# Altium project nora chirp.PrjPCB
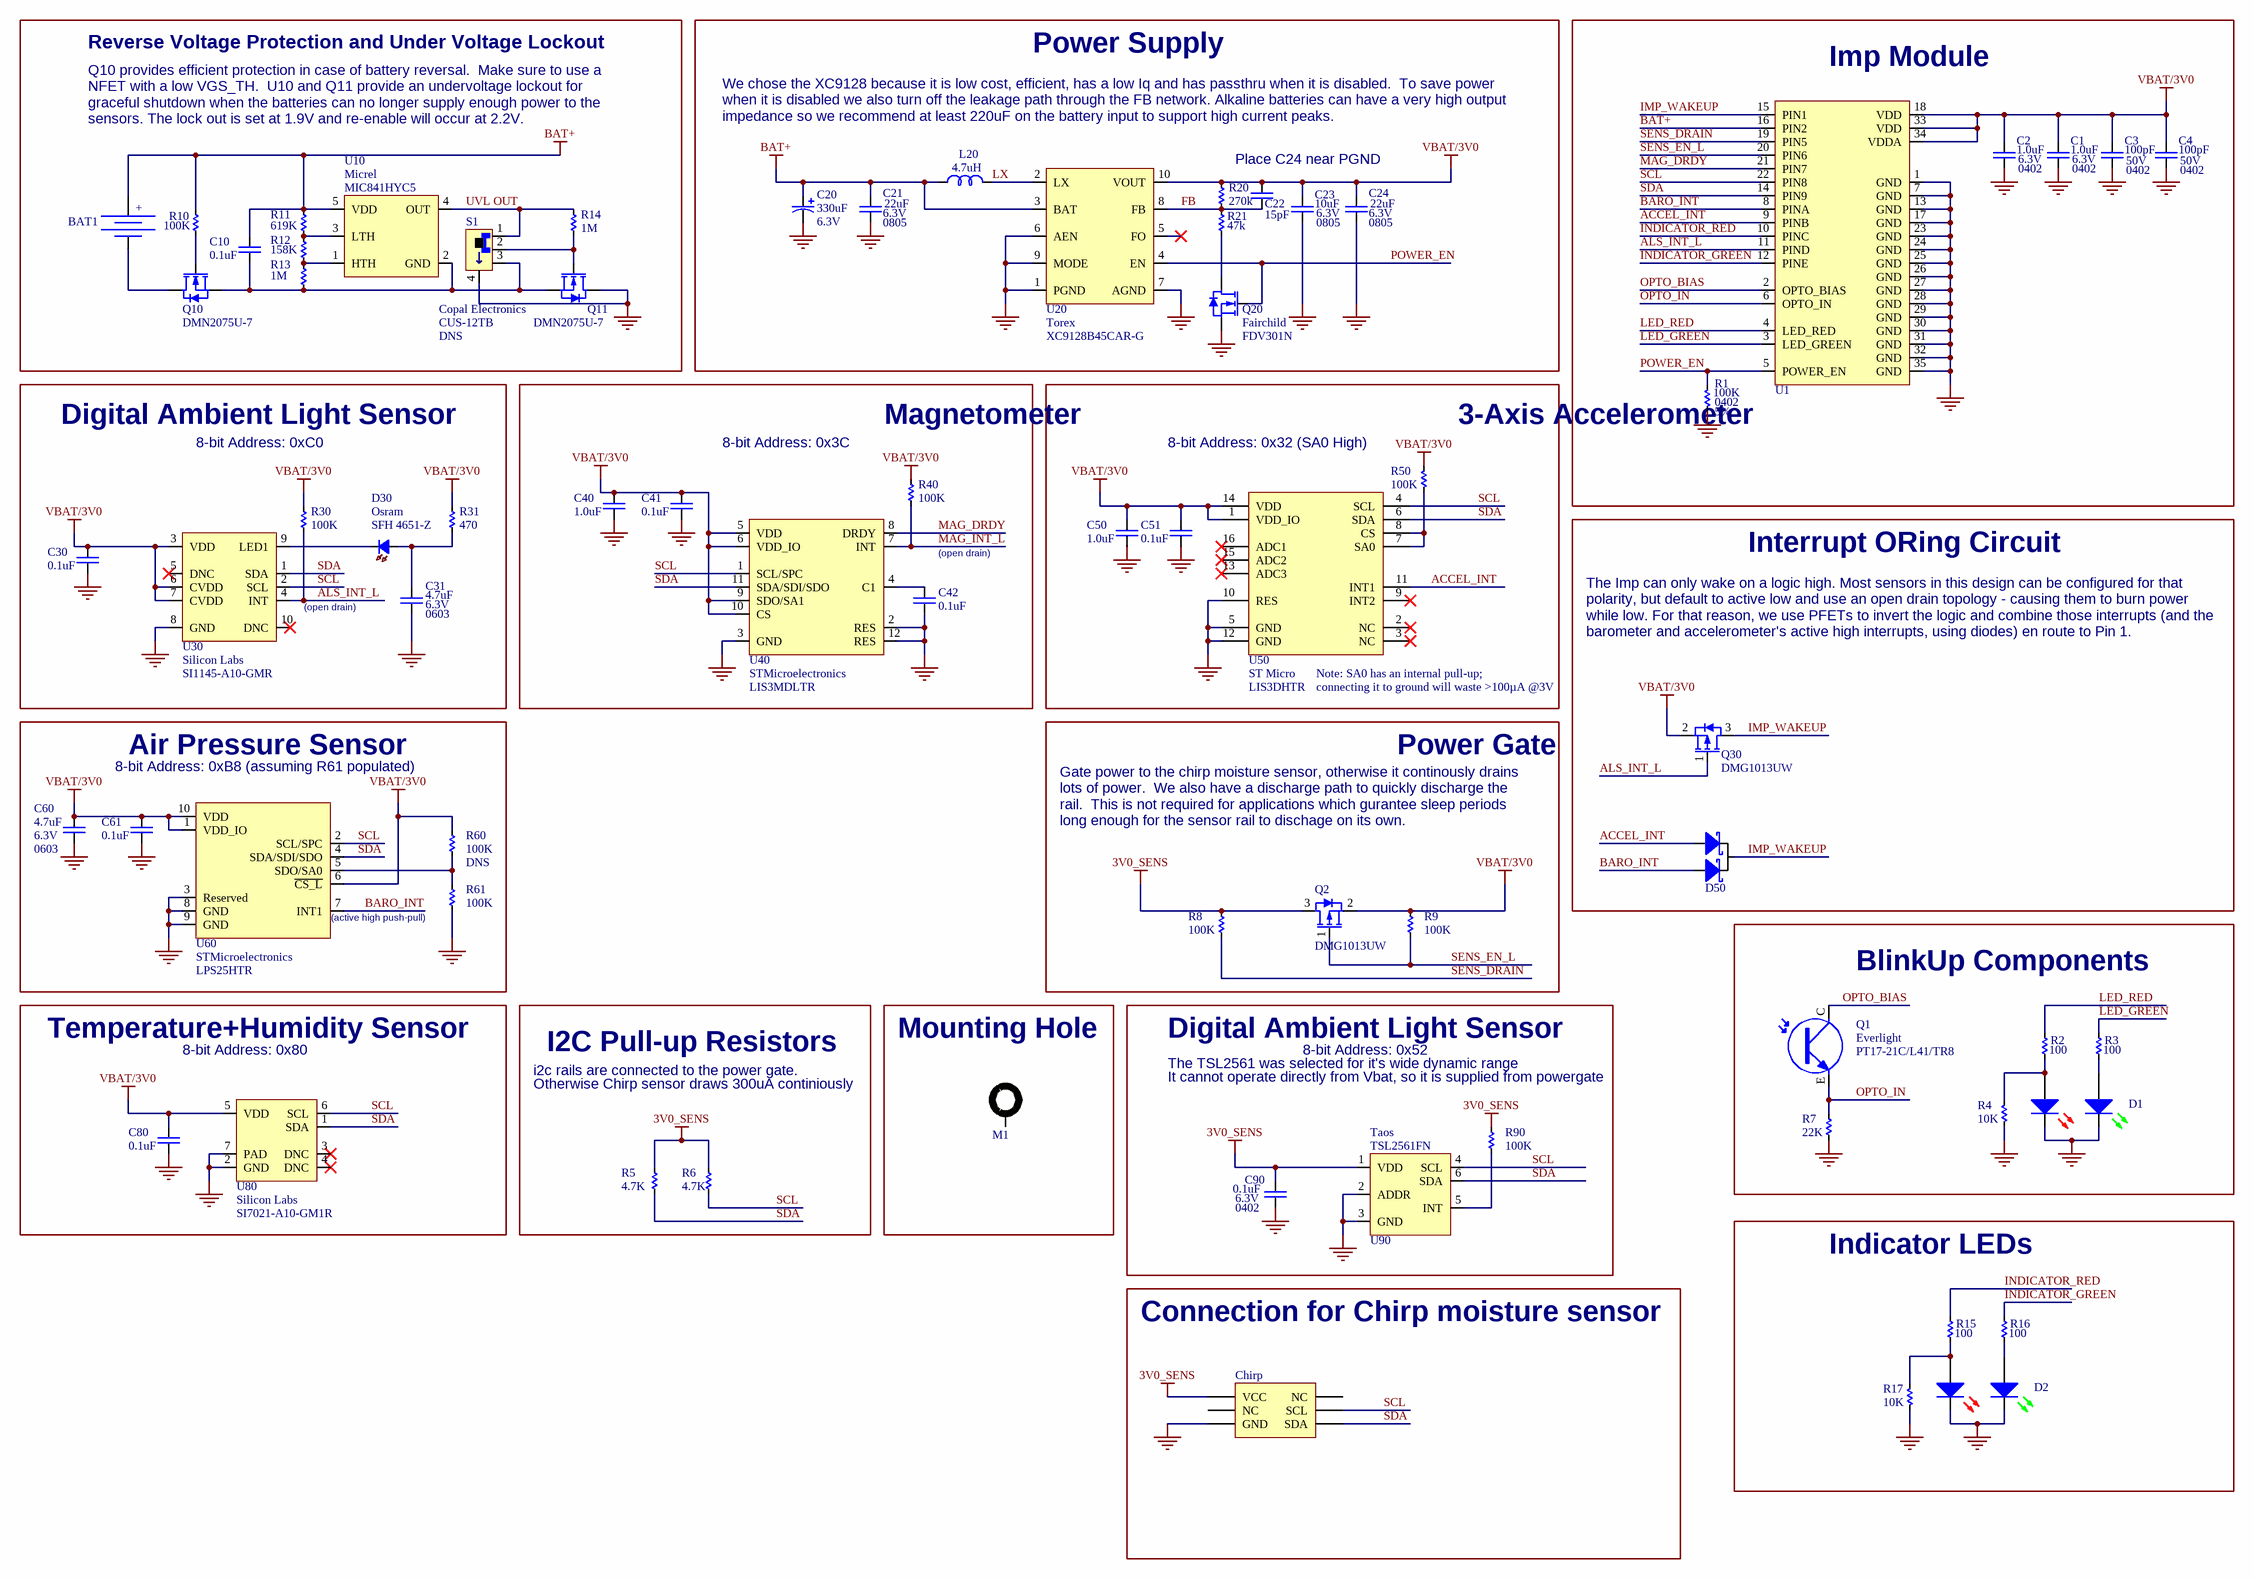
[diagram p0: nora_chirp.SchDoc]
1 sheet, 71 parts. Net scope: global (net labels, ports and power ports of the same name join across sheets).
Board file: nora_chirp.PcbDoc

## Sheet nora_chirp.SchDoc: Impee Nora
size A2; Revision: 5.0; SheetNumber: 1; SheetTotal: 1; PageSetup: Record=PageOptions|CenterHorizontal=True|CenterVertical=True|PrintScale=0.90|XCorrection=1.00|YCorrection=1.00|PrintKind=0|BorderSize=5000000|LeftOffset=0|BottomOffset=0|Orientation=2|PaperLength=1000|PaperWidth=1000|Scale=100|PaperSource=276|PrintQuality=-3|MediaType=1|DitherType=10|PrintScaleMode=1|PaperKind=Tabloid|PaperIndex=3; ProjectName: impee-nora

### Parts
BAT1  BATTERY  [12BH321P-GR]  (value not drawn)
C1  value 1.0uF  Voltage: 6.3V  Package: 0402  [CAPC1005X07N]  (hidden comment: Ceramic Capacitor)
C2  value 1.0uF  Voltage: 6.3V  Package: 0402  [CAPC1005X07N]  (hidden comment: Ceramic Capacitor)
C3  value 100pF  Voltage: 50V  Package: 0402  [CAPC1005X07N]  (hidden comment: Ceramic Capacitor)
C4  value 100pF  Voltage: 50V  Package: 0402  [CAPC1005X07N]  (hidden comment: Ceramic Capacitor)
C10  value 0.1uF  [CAPC1005X07N]  (hidden comment: Ceramic Capacitor)
C20  value 330uF  Voltage: 6.3V  [CAPAE8983X55N]  (hidden comment: Polarized Capacitor)
C21  value 22uF  Voltage: 6.3V  Package: 0805  [CAPC2012X14N]  (hidden comment: Ceramic Capacitor)
C22  value 15pF  [CAPC1005X07N]  (hidden comment: Ceramic Capacitor)
C23  value 10uF  Voltage: 6.3V  Package: 0805  [CAPC2012X14N]  (hidden comment: Ceramic Capacitor)
C24  value 22uF  Voltage: 6.3V  Package: 0805  [CAPC2012X14N]  (hidden comment: Ceramic Capacitor)
C30  value 0.1uF  [CAPC1005X07N]  (hidden comment: Ceramic Capacitor)
C31  value 4.7uF  Voltage: 6.3V  Package: 0603  [CAPC1608X10N]  (hidden comment: Ceramic Capacitor)
C40  value 1.0uF  [CAPC1005X07N]  (hidden comment: Ceramic Capacitor)
C41  value 0.1uF  [CAPC1005X07N]  (hidden comment: Ceramic Capacitor)
C42  value 0.1uF  [CAPC1005X07N]  (hidden comment: Ceramic Capacitor)
C50  value 1.0uF  [CAPC1005X07N]  (hidden comment: Ceramic Capacitor)
C51  value 0.1uF  [CAPC1005X07N]  (hidden comment: Ceramic Capacitor)
C60  value 4.7uF  Voltage: 6.3V  Package: 0603  [CAPC1608X10N]  (hidden comment: Ceramic Capacitor)  (no BOM)
C61  value 0.1uF  [CAPC1005X07N]  (hidden comment: Ceramic Capacitor)
C80  value 0.1uF  [CAPC1005X07N]  (hidden comment: Ceramic Capacitor)
C90  value 0.1uF  Voltage: 6.3V  Package: 0402  [CAPC1005X07N]  (hidden comment: Ceramic Capacitor)
Chirp  (no value)  [Chirp HDR3+1]
D1  LED Red and Green  [LED1616X07N-REDGREEN]  (value not drawn)
D2  LED Red and Green  [LED1616X07N-REDGREEN]  (value not drawn)
D30  Manufacturer: Osram  Manufacturer Part Number: SFH 4651-Z  [LED3324X17N]  (hidden comment: LED IR)
D50  Dual Schottky Diode  [SOT95P300X130-3N]  (value not drawn)
L20  value 4.7uH  [INDP6060X28N]  (hidden comment: Inductor)
M1  Mounting Hole  [4-40-NP]  (value not drawn)  (no BOM)
Q1  Manufacturer: Everlight  Manufacturer Part Number: PT17-21C/L41/TR8  [PHOTOTRANS2012X13]  (hidden comment: PHOTOTRANSISTOR)
Q2  Manufacturer Part Number: DMG1013UW  [SOT65P210X110-3N]  (hidden comment: PFET)
Q10  Manufacturer Part Number: DMN2075U-7  [SOT95P300X130-3N]  (hidden comment: N-Channel MOSFET)
Q11  Manufacturer Part Number: DMN2075U-7  [SOT95P300X130-3N]  (hidden comment: N-Channel MOSFET)
Q20  Manufacturer: Fairchild  Manufacturer Part Number: FDV301N  [SOT95P300X130-3N]  (hidden comment: N-Channel MOSFET)
Q30  Manufacturer Part Number: DMG1013UW  [SOT65P210X110-3N]  (hidden comment: PFET)  (no BOM)
R1  value 100K  Package: 0402  Tolerance: 5%  [RESC1005X04N]  (hidden comment: Resistor)
R2  value 100  [RESC1005X04N]  (hidden comment: Resistor)
R3  value 100  [RESC1005X04N]  (hidden comment: Resistor)
R4  value 10K  [RESC1005X04N]  (hidden comment: Resistor)
R5  value 4.7K  [RESC1005X04N]  (hidden comment: Resistor)
R6  value 4.7K  [RESC1005X04N]  (hidden comment: Resistor)
R7  value 22K  [RESC1005X04N]  (hidden comment: Resistor)
R8  value 100K  [RESC1005X04N]  (hidden comment: Resistor)
R9  value 100K  [RESC1005X04N]  (hidden comment: Resistor)
R10  value 100K  [RESC1005X04N]  (hidden comment: Resistor)
R11  value 619K  [RESC1005X04N]  (hidden comment: Resistor)
R12  value 158K  [RESC1005X04N]  (hidden comment: Resistor)
R13  value 1M  [RESC1005X04N]  (hidden comment: Resistor)
R14  value 1M  [RESC1005X04N]  (hidden comment: Resistor)
R15  value 100  [RESC1005X04N]  (hidden comment: Resistor)
R16  value 100  [RESC1005X04N]  (hidden comment: Resistor)
R17  value 10K  [RESC1005X04N]  (hidden comment: Resistor)
R20  value 270k  [RESC1005X04N]  (hidden comment: Resistor)
R21  value 47k  [RESC1005X04N]  (hidden comment: Resistor)
R30  value 100K  [RESC1005X04N]  (hidden comment: Resistor)
R31  value 470  [RESC1005X04N]  (hidden comment: Resistor)
R40  value 100K  [RESC1005X04N]  (hidden comment: Resistor)
R50  value 100K  [RESC1005X04N]  (hidden comment: Resistor)
R60  value 100K  BOMOPTION: DNS  [RESC1005X04N]  (hidden comment: Resistor)  (no BOM)
R61  value 100K  [RESC1005X04N]  (hidden comment: Resistor)
R90  value 100K  [RESC1005X04N]  (hidden comment: Resistor)
S1  Manufacturer: Copal Electronics  BOMOPTION: DNS  [CUS-12TB]  (hidden comment: Slide Switch)  (no BOM)
U1  imp module  [IMP_MODULE]  (value not drawn)
U10  Manufacturer: Micrel  Manufacturer Part Number: MIC841HYC5  [SOT65P200X125-5N]  (hidden comment: MIC841)
U20  Manufacturer: Torex  Manufacturer Part Number: XC9128B45CAR-G  [MSOP50P490X116-10N]  (hidden comment: XC9128)
U30  Manufacturer: Silicon Labs  Manufacturer Part Number: SI1145-A10-GMR  [QFN50P200X200X75-10N]  (hidden comment: SI1145)
U40  Manufacturer: STMicroelectronics  Manufacturer Part Number: LIS3MDLTR  [PQFN50P200X200X100-12N]  (hidden comment: LIS3MDL)  (no BOM)
U50  Manufacturer: ST Micro  [LGA50P300X300X100-16N-ST]  (hidden comment: LIS3DHTR)
U60  Manufacturer: STMicroelectronics  Manufacturer Part Number: LPS25HTR  [PQFN60P250X250X100-10N]  (hidden comment: LPS25H)  (no BOM)
U80  Manufacturer: Silicon Labs  Manufacturer Part Number: SI7021-A10-GM1R  [QFN100P300X300X80_HS-7N]  (hidden comment: SI7021)
U90  Manufacturer: Taos  Manufacturer Part Number: TSL2561FN  [TSL2561]  (hidden comment: TSL2561)

### Blocks framed on the sheet
Reverse Voltage Protection and Under Voltage Lockout: BAT1 C10 Q10 Q11 R10-R14 S1 U10
Power Supply: C20-C24 L20 Q20 R20 R21 U20
Imp Module: C1-C4 R1 U1
Digital Ambient Light Sensor: C30 C31 D30 R30 R31 U30
Magnetometer: C40-C42 R40 U40
3-Axis Accelerometer: C50 C51 R50 U50
Interrupt ORing Circuit: D50 Q30
Air Pressure Sensor: C60 C61 R60 R61 U60
Power Gate: Q2 R8 R9
BlinkUp Components: D1 Q1 R2-R4 R7
Temperature+Humidity Sensor: C80 U80
I2C Pull-up Resistors: R5 R6
Mounting Hole: M1
Digital Ambient Light Sensor: C90 R90 U90
Indicator LEDs: D2 R15-R17
Connection for Chirp moisture sensor: Chirp

### Nets
3V0_SENS: C90.2 Chirp.1(VCC) Q2.3(D) R5.1 R6.1 R8.1 R90.1 U90.1(VDD)
BAT+: BAT1.+ C10.2 C20.1 C21.2 L20.1 R10.2 R11.1 U1.16(PIN2) U10.5(VDD) U20.3(BAT)
GND: C1.1 C2.1 C3.1 C4.1 C20.2 C21.1 C23.1 C24.1 C30.1 C31.1 C40.1 C41.1 C42.1 C50.1 C51.1 C60.1 C61.1 C80.1 C90.1 Chirp.3(GND) D1.KG D1.KR D2.KG D2.KR Q11.3(D) Q20.2(S) R1.1 R4.1 R7.2 R17.1 R61.2 S1.4 U1.1(GND) U1.7(GND) U1.13(GND) U1.17(GND) U1.23(GND) U1.24(GND) U1.25(GND) U1.26(GND) U1.27(GND) U1.28(GND) U1.29(GND) U1.30(GND) U1.31(GND) U1.32(GND) U1.35(GND) U20.1(PGND) U20.6(AEN) U20.7(AGND) U20.9(MODE) U30.8(GND) U40.2(RES) U40.3(GND) U40.12(RES) U50.5(GND) U50.10(RES) U50.12(GND) U60.3(Reserved) U60.8(GND) U60.9(GND) U80.2(GND) U80.7(PAD) U90.2(ADDR) U90.3(GND)
VBAT/3V0: C1.2 C2.2 C3.2 C4.2 C22.2 C23.2 C24.2 C30.2 C40.2 C41.2 C50.2 C51.2 C60.2 C61.2 C80.2 Q2.2(S) Q30.2(S) R9.1 R20.1 R30.1 R31.1 R40.1 R50.2 R60.1 U1.18(VDD) U1.33(VDD) U1.34(VDDA) U20.10(VOUT) U30.3(VDD) U30.6(CVDD) U30.7(CVDD) U40.5(VDD) U40.6(VDD_IO) U40.9(SDO/SA1) U40.10(CS) U50.1(VDD_IO) U50.14(VDD) U60.1(VDD_IO) U60.6(~{CS_L}) U60.10(VDD) U80.5(VDD)
ACCEL_INT: D50.1 U1.9(PINB) U50.11(INT1)
ALS_INT_L: Q30.1(G) R30.2 U1.11(PIND) U30.4(INT)
BARO_INT: D50.2 U1.8(PINA) U60.7(INT1)
FB: C22.1 R20.2 R21.2 U20.8(FB)
IMP_WAKEUP: D50.3 Q30.3(D) U1.15(PIN1)
INDICATOR_GREEN: R16.1 U1.12(PINE)
INDICATOR_RED: R15.1 U1.10(PINC)
LED_GREEN: R3.1 U1.3(LED_GREEN)
LED_RED: R2.1 U1.4(LED_RED)
LX: L20.2 U20.2(LX)
MAG_DRDY: U1.21(PIN7) U40.8(DRDY)
MAG_INT_L: R40.2 U40.7(INT)
OPTO_BIAS: Q1.C U1.2(OPTO_BIAS)
OPTO_IN: Q1.E R7.1 U1.6(OPTO_IN)
POWER_EN: Q20.1(G) R1.2 U1.5(POWER_EN) U20.4(EN)
SCL: Chirp.5(SCL) R6.2 U1.22(PIN8) U30.2(SCL) U40.1(SCL/SPC) U50.4(SCL) U60.2(SCL/SPC) U80.6(SCL) U90.4(SCL)
SDA: Chirp.2(SDA) R5.2 U1.14(PIN9) U30.1(SDA) U40.11(SDA/SDI/SDO) U50.6(SDA) U60.4(SDA/SDI/SDO) U80.1(SDA) U90.6(SDA)
SENS_DRAIN: R8.2 U1.19(PIN5)
SENS_EN_L: Q2.1(G) R9.2 U1.20(PIN6)
UVL OUT: R14.1 S1.1 U10.4(OUT)
NetBAT1_-: BAT1.- Q10.3(D)
NetC10_1: C10.1 Q10.2(S) Q11.2(S) R13.2 S1.3 U10.2(GND)
NetC31_2: C31.2 D30.A R31.2
NetC42_2: C42.2 U40.4(C1)
NetD1_AG: D1.AG R3.2
NetD1_AR: D1.AR R2.2 R4.2
NetD2_AG: D2.AG R16.2
NetD2_AR: D2.AR R15.2 R17.2
NetD30_K: D30.K U30.9(LED1)
NetQ10_1: Q10.1(G) R10.1
NetQ11_1: Q11.1(G) R14.2 S1.2
NetQ20_3: Q20.3(D) R21.1
NetR11_2: R11.2 R12.1 U10.3(LTH)
NetR12_2: R12.2 R13.1 U10.1(HTH)
NetR50_1: R50.1 U50.7(SA0) U50.8(CS)
NetR60_2: R60.2 R61.1 U60.5(SDO/SA0)
NetR90_2: R90.2 U90.5(INT)

Not connected (* = marked no-connect by the designer): Chirp 4(NC) 6(NC); M1 1; U20 5(FO)*; U30 5(DNC)* 10(DNC)*; U50 2(NC)* 3(NC)* 9(INT2)* 13(ADC3)* 15(ADC2)* 16(ADC1)*; U80 3(DNC)* 4(DNC)*

### Notes on the sheet
- Q10 provides efficient protection in case of battery reversal.  Make sure to use a NFET with a low VGS_TH.  U10 and Q11 provide an undervoltage lockout for graceful shutdown when the batteries can no longer supply enough power to the sensors. The lock out is set at 1.9V and re-enable will occur at 2.2V.
- We chose the XC9128 because it is low cost, efficient, has a low Iq and has passthru when it is disabled.  To save power when it is disabled we also turn off the leakage path through the FB network. Alkaline batteries can have a very high output impedance so we recommend at least 220uF on the battery input to support high current peaks.
- Place C24 near PGND
- 8-bit Address: 0xC0
- 8-bit Address: 0x3C
- 8-bit Address: 0x32 (SA0 High)
- (near U30) (open drain)
- (open drain)
- (near U50) Note: SA0 has an internal pull-up;
- The Imp can only wake on a logic high. Most sensors in this design can be configured for that polarity, but default to active low and use an open drain topology - causing them to burn power while low. For that reason, we use PFETs to invert the logic and combine those interrupts (and the barometer and accelerometer's active high interrupts, using diodes) en route to Pin 1.
- (near U50) connecting it to ground will waste >100µA @3V
- 8-bit Address: 0xB8 (assuming R61 populated)
- Gate power to the chirp moisture sensor, otherwise it continously drains lots of power.  We also have a discharge path to quickly discharge the rail.  This is not required for applications which gurantee sleep periods long enough for the sensor rail to dischage on its own.
- (near U60) (active high push-pull)
- 8-bit Address: 0x80
- i2c rails are connected to the power gate.
- The TSL2561 was selected for it's wide dynamic range
- (near R90) It cannot operate directly from Vbat, so it is supplied from powergate
- 8-bit Address: 0x52
- Otherwise Chirp sensor draws 300uA continiously
- Copyright © 2014, Electric Imp Inc.
  Permission is hereby granted, free of charge, to any person obtaining a copy of this work and associated documentation files (the "Work"), to deal in the Work without restriction, including without limitation the rights to use, copy, modify, merge, publish, distribute, sublicense, and/or sell copies of the Work, and to permit persons to whom the Work is furnished to do so, subject to the following conditions:
  The above copyright notice and this permission notice shall be included in all copies or substantial portions of the Work.
  THE WORK IS PROVIDED "AS IS", WITHOUT WARRANTY OF ANY KIND, EXPRESS OR IMPLIED, INCLUDING BUT NOT LIMITED TO THE WARRANTIES OF MERCHANTABILITY, FITNESS FOR A PARTICULAR PURPOSE AND NONINFRINGEMENT. IN NO EVENT SHALL THE AUTHORS OR COPYRIGHT HOLDERS BE LIABLE FOR ANY CLAIM, DAMAGES OR OTHER LIABILITY, WHETHER IN AN ACTION OF CONTRACT, TORT OR OTHERWISE, ARISING FROM, OUT OF OR IN CONNECTION WITH THE WORK OR THE USE OR OTHER DEALINGS IN THE WORK.
- Design:
- Sheet:
- of
- Date:
- Time:
- Rev:
- Electric Imp
- 5050 El Camino Real, #221
- Los Altos, CA 94022
- File:

### Library data of the parts
BAT1 = BAT00006: 2xAA Series Battery Clip with Through-Hole PCB Mount; Manufacturer: Eagle Plastic Devices; Part Number: BAT00006; Manufacturer Part Number: 12BH321P-GR; Supplier 1: Mouser; Supplier Part Number 1: 12BH321P-GR; Supplier Price 1: 0.33; ComponentLink1URL: http://www.mouser.com/ProductDetail/Eagle-Plastic-Devices/12BH321P-GR/?qs=sGAEpiMZZMt13fpse6CWDe8CZN6lv7uJ5DFrvufekr8%3d
C1 C2 C40 C50 = CAPC00005: CAP,X5R,1.0uF,10%,6.3V, 0402,#; Manufacturer: Murata; Manufacturer Part Number: GRM155R60J105KE19D; Tolerance: 10%; Dielectric: X5R; Part Number: CAPC00005; Manufacturer 2: Samsung; Manufacturer Part Number 2: CL05A105KQ5NNNC; Supplier 1: Digi-Key; Supplier Part Number 1: 490-1320-1-ND; Supplier Price 1: 0.0087; Supplier 2: Digi-Key; Supplier Part Number 2: 1276-1010-1-ND; Supplier Price 2: 0.009; Stock Date: 3/12/2013; Stock Quantity: 1000
C3 C4 = CAPC00043: CAP,C0G,100pF,5%,50V,0402; Manufacturer: Yageo; Manufacturer Part Number: CC0402JRNPO9BN101; Tolerance: 5%; Dielectric: C0G; Part Number: CAPC00043; Manufacturer 2: Samsung; Manufacturer Part Number 2: CL05C101JB5NNNC; Supplier 1: Digi-Key; Supplier Part Number 1: 311-1024-1-ND; Supplier Price 1: 0.00324; Supplier 2: Digi-Key; Supplier Part Number 2: 1276-1025-1-ND; Supplier Price 2: 0.00324; Stock Date: 3/12/2013; Stock Quantity: 500
C10 C30 C41 C42 C51 C61 C80 = CAPC00103: CAP,X5R,0.1uF,10%,6.3V, 0402,#; Manufacturer: Samsung; Manufacturer Part Number: CL05A104KQ5NNNC; Tolerance: 10%; Dielectric: X5R; Part Number: CAPC00103; Supplier 1: Digi-Key; Supplier Part Number 1: 1276-1442-1-ND; Supplier Price 1: 0.003
C20 = CAPC00106: CAP,Alum,330uF,20%,6.3V,SMD; Manufacturer: Nichicon; Manufacturer Part Number: UWX0J331MCL1GB; Tolerance: 20%; Dielectric: Alum; Part Number: CAPC00106; Supplier 1: Digi-Key; Supplier Part Number 1: 493-2091-1-ND; Supplier Price 1: 0.1015
C21 C24 = CAPC00039: CAP,X5R,22uF,10%,6.3V,0805,#; Manufacturer: TDK; Manufacturer Part Number: C2012X5R0J226K/1.25; Tolerance: 10%; Dielectric: X5R; Part Number: CAPC00039; Manufacturer 2: Taiyo Yuden; Manufacturer Part Number 2: JMK325BJ226KM-T; Supplier 1: Digi-Key; Supplier Part Number 1: 445-7679-1-ND; Supplier Price 1: 0.225; Supplier 2: Digi-Key; Supplier Part Number 2: 587-1471-2-ND; Supplier Price 2: 0.2288; Stock Date: 3/12/2013; Stock Quantity: 1049
C22 = CAPC00105: CAP,C0G,15pF,5%,50V,0402; Manufacturer: Samsung; Manufacturer Part Number: CL05C150JB5NNNC; Tolerance: 5%; Dielectric: C0G; Part Number: CAPC00105; Supplier 1: Digi-Key; Supplier Part Number 1: 1276-1179-1-ND; Supplier Price 1: 0.00324
C23 = CAPC00036: CAP,X5R,10uF,10%,6.3V,0805,#; Manufacturer: Yageo; Manufacturer Part Number: CC0805KKX5R5BB106; Tolerance: 10%; Dielectric: X5R; Part Number: CAPC00036; Manufacturer 2: Taiyo Yuden; Manufacturer Part Number 2: JMK212BJ106KD-T; Supplier 1: Digi-Key; Supplier Part Number 1: 311-1459-1-ND; Supplier Price 1: 0.03399; Supplier 2: Digi-Key; Supplier Part Number 2: 587-1304-1-ND; Supplier Price 2: 0.0408; Stock Date: 3/12/2013; Stock Quantity: 1000
C31 C60 = CAPC00033: CAP,X5R,4.7uF,10%,6.3V,0603,#; Manufacturer: Taiyo Yuden; Manufacturer Part Number: JMK107BJ475KA-T; Tolerance: 10%; Dielectric: X5R; Part Number: CAPC00033; Manufacturer 2: Yageo; Manufacturer Part Number 2: CC0603KRX5R5BB475; Supplier 1: Digi-Key; Supplier Part Number 1: 587-1785-1-ND; Supplier Price 1: 0.02475; Supplier 2: Digi-Key; Supplier Part Number 2: 311-1521-1-ND; Supplier Price 2: 0.02899; Stock Quantity: 1000; Stock Date: 3/12/2013
C90 = CAPC00002: CAP,X5R,0.1uF,10%,6.3V, 0402,#; Manufacturer: TDK; Manufacturer Part Number: C1005X5R0J104K; Tolerance: 10%; Dielectric: X5R; Part Number: CAPC00002; Manufacturer 2: Murata; Manufacturer Part Number 2: GRM155R60J104KA01D; Supplier 1: Digi-Key; Supplier Part Number 1: 445-1266-1-ND; Supplier Price 1: 0.0066; Supplier 2: Mouser; Supplier Part Number 2: 81-GRM155R60J104KA1D; Supplier Price 2: 0.007; Stock Date: 4/19/2013; Stock Quantity: 300
Chirp = Chirp HDR3+1: header for chirp; LatestRevisionDate: 17-Jul-2002; LatestRevisionNote: Re-released for DXP Platform.; Publisher: Altium Limited
D1 D2 = LED00012: LED, Red and Green, 2/2V, 631/571nm, 25/35mcd, SMT; Manufacturer: Liteon; Manufacturer Part Number: LTST-C195KGJRKT; Color: Red/Green; Millicandela Rating (min): 25mcd, 35mcd; Voltage - Forward (Vf) Typ: 2V, 2V; Current - Test: 20mA; Wavelength - Dominant: 631nm, 571nm; Wavelength - Peak: 639nm, 574nm; Viewing Angle: 130°; Lens Type: Clear; Part Number: LED00012; Package: SMT; Supplier 1: Digi-Key; Supplier Part Number 1: 160-1452-1-ND; Supplier Price 1: 0.1206; Stock Quantity: 31; Stock Date: 8/22/2014; ComponentLink1URL: http://media.digikey.com/pdf/Data%20Sheets/Lite-On%20PDFs/LTST-C195KGJRKT.pdf
D30 = LED00053: LED, IR, 1.6V@70mA, 850nm, SMT; Voltage - Forward (Vf) Typ: 1.6V; Current - Test: 70mA; Wavelength - Peak: 860nm; Viewing Angle: 20º; Lens Type: Clear; Part Number: LED00053; Package: SMT; Color: IR; Millicandela Rating (min): -; Wavelength - Dominant: 850nm; Supplier 1: Digi-Key; Supplier Part Number 1: 475-2874-1-ND; Supplier Price 1: 0.45964; ComponentLink1URL: http://www.digikey.com/product-detail/en/SFH%204651-Z/475-2874-1-ND/2207280
D50 = SCHOTTKY00009: DIODE, Schottky, 200mA, 30V, Dual, Common Cathode, SOT23; Manufacturer: Fairchild; Diode Type: Schottky, Dual; Voltage - Forward (Vf) (Max) @ If: 800mV @ 100mA; Part Number: SCHOTTKY00009; Voltage - DC Reverse (Vr) (Max): 30V; Current - Average Rectified (Io): 200mA; Package: SOT-23; Manufacturer Part Number: BAT54C; Supplier 1: Digi-key; Supplier Part Number 1: BAT54CFSCT-ND; Supplier Price 1: 0.03986; ComponentLink1URL: http://www.digikey.com/product-detail/en/BAT54C/BAT54CFSCT-ND/458929
L20 = IND00007: IND, 4.7uH, 20%, 2.7A Isat, 403 mOhm, 6028; Manufacturer: Taiyo Yuden; Manufacturer Part Number: NR6028T4R7M; Part Number: IND00007; Package: 6028; Current: 2.7A; Current - Temperature Rise: 2.7A; Tolerance: 20%; DC Resistance (DCR): 403 mOhm; Supplier 1: Digi-Key; Supplier Part Number 1: 587-2100-1-ND; Supplier Price 1: 0.15525; ComponentLink1URL: http://www.yuden.co.jp/productdata/catalog/en/wound04_e.pdf; Stock Date: 3/6/2013; Stock Quantity: 31
M1 = MNT00004: #4-40 Mounting Hole Non Plated; Part Number: MNT00004
Q1 = PHOTO00002: Phototrans, Clear, Top View, 940nm, 0.4V, 1mA, 0805; Part Number: PHOTO00002; Package: 0805; Lens Type: Clear; Supplier 1: Digi-Key; Supplier Part Number 1: 1080-1382-1-ND; Supplier Price 1: 0.07101; Stock Quantity: 7; Stock Date: 10/24/2012; ComponentLink1URL: http://www.digikey.com/product-detail/en/PT17-21C%2FL41%2FTR8/1080-1382-1-ND/2676116
Q2 Q30 = PFET00009: PFET, 20V, 820mA, 1V, SOT323; Manufacturer: Diodes Inc; Current - Continuous Drain (Id) @ 25° C: 0.820A; Rds On (Max) @ Id, Vgs: 750 mOhm @ 430mA, 4.5V; Vgs(th) (Max) @ Id: 1V @ 250µA; Power - Max: 310mW; Part Number: PFET00009; Drain to Source Voltage (Vdss): 20V; Supplier 1: Digi-key; Supplier Part Number 1: DMG1013UW-7DICT-ND; Supplier Price 1: 0.06575; ComponentLink1URL: http://www.digikey.com/product-detail/en/DMG1013UW-7/DMG1013UW-7DICT-ND/2183252
Q10 Q11 = NFET00004: NFET, 20V, 4.2A, SOT23; Manufacturer: Diodes Incorporated; Rds On (Max) @ Id, Vgs: 45 mOhm @ 3.1A, 2.5V; Vgs(th) (Max) @ Id: 1.0V @ 250uA; Power - Max: 800mW; Part Number: NFET00004; Drain to Source Voltage (Vdss): 20V; Current - Continuous Drain (Id) @ 25° C: 4.2A; Package: SOT23; Supplier 1: Digi-Key; Supplier Part Number 1: DMN2075U-7DICT-ND; Supplier Price 1: 0.08295; Stock Quantity: 41; Stock Date: 3/5/2013; ComponentLink1URL: http://www.diodes.com/datasheets/ds31837.pdf
Q20 = NFET00003: NFET, 25V, 220mA, SOT23; Rds On (Max) @ Id, Vgs: 5 ohm @ 200mA, 2.7V; Vgs(th) (Max) @ Id: 1.06V @ 250uA; Power - Max: 350mW; Part Number: NFET00003; Drain to Source Voltage (Vdss): 25V; Current - Continuous Drain (Id) @ 25° C: 220mA; Package: SOT23; Supplier 1: Digi-key; Supplier Part Number 1: FDV301NCT-ND; Supplier Price 1: 0.04155; Stock Date: 3/5/2013; ComponentLink1URL: http://www.fairchildsemi.com/ds/FD/FDV301N.pdf
R1 R10 R50 = RES00001: RES,100k,5%,0.063W,0402,#; Manufacturer: Samsung; Manufacturer Part Number: RC1005J104CS; Part Number: RES00001; Power: 0.063W; Manufacturer 2: ROHM; Manufacturer Part Number 2: MCR01MRTJ104; Supplier 1: Digi-Key; Supplier Part Number 1: 1276-4424-1-ND; Supplier Price 1: 0.0023; Supplier 2: Digi-Key; Supplier Part Number 2: HM100KCECT-ND; Supplier Price 2: 0.00233; Stock Date: 4/5/2013; Stock Quantity: 2100
R2 R3 R15 R16 = RES00024: RES,100,1%,0.063W,0402,#; Manufacturer: Yageo; Manufacturer Part Number: RC0402FR-07100RL; Part Number: RES00024; Package: 0402; Tolerance: 1%; Power: 0.063W; Manufacturer 2: ROHM; Manufacturer Part Number 2: MCR01MRTF1000; Supplier 1: Digi-Key; Supplier Part Number 1: 311-100LRCT-ND; Supplier Price 1: 0.0027; Supplier 2: Digi-Key; Supplier Part Number 2: RHM100CDCT-ND; Supplier Price 2: 0.0048; Stock Date: 4/5/2013; Stock Quantity: 1000
R4 R17 = RES00006: RES,10k,5%,0.063W,0402,#; Manufacturer: Stackpole; Manufacturer Part Number: RMCF0402JT10K0; Part Number: RES00006; Package: 0402; Tolerance: 5%; Power: 0.063W; Manufacturer 2: ROHM; Manufacturer Part Number 2: MCR01MRTJ103; Supplier 1: Digi-Key; Supplier Part Number 1: RMCF0402JT10K0CT-ND; Supplier Price 1: 0.00256; Supplier 2: Digi-Key; Supplier Part Number 2: RHM10KCECT-ND; Supplier Price 2: 0.00352; Stock Quantity: 120; Stock Date: 4/19/2013
R5 R6 = RES00005: RES,4.7K,5%,0.063W,0402,#; Manufacturer: Yageo; Manufacturer Part Number: RC0402JR-074K7L; Part Number: RES00005; Power: 0.063W; Manufacturer 2: ROHM; Manufacturer Part Number 2: MCR01MRTJ472; Supplier 1: Digi-Key; Supplier Part Number 1: 311-4.7KJRCT-ND; Supplier Price 1: 0.00237; Supplier 2: Digi-Key; Supplier Part Number 2: RHM4.7KCECT-ND; Supplier Price 2: 0.00352; Stock Quantity: 100; Stock Date: 4/19/2013
R7 = RES00007: RES,22K,5%,0.063W,0402; Manufacturer: Yageo; Manufacturer Part Number: RC0402JR-0722KL; Part Number: RES00007; Power: 0.063W; Manufacturer 2: Panasonic; Manufacturer Part Number 2: ERJ-2GEJ223X; Supplier 1: Digi-Key; Supplier Part Number 1: 311-22KJRCT-ND; Supplier Price 1: 0.00237; Supplier 2: Digi-Key; Supplier Part Number 2: P22KJCT-ND; Supplier Price 2: 0.0048
R8 R9 R30 R40 R60 R61 R90 = RES00001: RES,100K,5%,0.063W,0402,#; Manufacturer: Samsung; Manufacturer Part Number: RC1005J104CS; Part Number: RES00001; Power: 0.063W; Manufacturer 2: ROHM; Manufacturer Part Number 2: MCR01MRTJ104; Supplier 1: Digi-Key; Supplier Part Number 1: 1276-4424-1-ND; Supplier Price 1: 0.0023; Supplier 2: Digi-Key; Supplier Part Number 2: HM100KCECT-ND; Supplier Price 2: 0.00233; Stock Quantity: 2100; Stock Date: 4/5/2013
R11 = RES00095: RES,619K Ohm,1%,0.063W,0402; Manufacturer: Samsung; Manufacturer Part Number: RC1005F6193CS; Part Number: RES00095; Power: 0.063W; Supplier 1: Digi-Key; Supplier Part Number 1: 1276-4272-1-ND; Supplier Price 1: 0.0035
R12 = RES00096: RES,158K Ohm,1%,0.063W,0402; Manufacturer: Samsung; Manufacturer Part Number: RC1005F1583CS; Part Number: RES00096; Power: 0.063W; Supplier 1: Digi-Key; Supplier Part Number 1: 1276-4217-1-ND; Supplier Price 1: 0.0035
R13 = RES00039: RES,1M,1%,0.1W,0402,#; Manufacturer: Stackpole; Manufacturer Part Number: RMCF0402FT1M00; Power: 0.063W; Part Number: RES00039; Manufacturer 2: Rohm; Manufacturer Part Number 2: MCR01MRTF1004; Supplier 1: Digi-Key; Supplier Part Number 1: RMCF0402FT1M00CT-ND; Supplier Price 1: 0.00384; Supplier 2: Digi-Key; Supplier Part Number 2: RHM1.00MCDCT-ND; Supplier Price 2: 0.0048; Stock Quantity: 1000; Stock Date: 4/5/2013
R14 = RES00010: RES,1M,5%,0.063W,0402,#; Manufacturer: Yageo; Manufacturer Part Number: RC0402JR-071ML; Part Number: RES00010; Power: 0.063W; Manufacturer 2: ROHM; Manufacturer Part Number 2: MCR01MRTJ105; Supplier 1: Digi-Key; Supplier Part Number 1: 311-1.0MJRCT-ND; Supplier Price 1: 0.00237; Supplier 2: Digi-Key; Supplier Part Number 2: RHM1.0MCECT-ND; Supplier Price 2: 0.00352; Stock Quantity: 13; Stock Date: 4/5/2013
R20 = RES00002: RES,220K,5%,0.063W,0402; Manufacturer: Yageo; Manufacturer Part Number: RC0402JR-07220KL; Part Number: RES00002; Power: 0.063W; Manufacturer 2: ROHM; Manufacturer Part Number 2: MCR01MZPJ224; Supplier 1: Digi-Key; Supplier Part Number 1: 311-220KJRCT-ND; Supplier Price 1: 0.0023; Supplier 2: Digi-Key; Supplier Part Number 2: RHM220KJCT-ND; Supplier Price 2: 0.00384
R21 = RES00041: RES,43K,1%,0.063W,0402; Manufacturer: Yageo; Manufacturer Part Number: RC0402FR-0743KL; Part Number: RES00041; Package: 0402; Tolerance: 1%; Power: 0.063W; Manufacturer 2: Rohm; Manufacturer Part Number 2: MCR01MZPF4302; Supplier 1: Digi-Key; Supplier Part Number 1: 311-43.0KLRCT-ND; Supplier Price 1: 0.0027; Supplier 2: Digi-Key; Supplier Part Number 2: RHM43.0KLCT-ND; Supplier Price 2: 0.00544; Stock Date: 4/5/2013; Stock Quantity: 10
R31 = RES00045: RES,470 Ohm,5%,0.063W,0402; Manufacturer: Yageo; Manufacturer Part Number: RC0402JR-07470RL; Part Number: RES00045; Power: 0.063W; Manufacturer 2: Stackpole; Manufacturer Part Number 2: RMCF0402JT470R; Supplier 1: Digi-Key; Supplier Part Number 1: 311-470JRCT-ND; Supplier Price 1: 0.00237; Supplier 2: Digi-Key; Supplier Part Number 2: RMCF0402JT470RCT-ND; Supplier Price 2: 0.00256; Stock Quantity: 95; Stock Date: 4/5/2013
S1 = SWITCH00002: SPDT Slide Switch, R/A, SMD; Manufacturer Part Number: CUS-12TB; Part Number: SWITCH00002; Supplier 1: Digi-Key; Supplier Part Number 1: 563-1102-1-ND; Supplier Price 1: 0.45778; ComponentLink1URL: http://www.digikey.com/product-detail/en/CUS-12TB/563-1102-1-ND/1124231
U1 = MOD00002: Module, Electric Imp Solder Down with Antenna; Manufacturer Part Number: IMP002; Part Number: MOD00002; Manufacturer: Electric Imp; Supplier 1: Digi-Key; Supplier Part Number 1: 1413-1001-1-ND; Supplier Price 1: 24.1001
U10 = IC00032: IC, Comparator with Reference and Programmable Hysteresis, SOT-353; Part Number: IC00032; Supplier 1: Digi-Key; Supplier Part Number 1: 576-2923-1-ND; Supplier Price 1: 0.504; ComponentLink1URL: http://www.micrel.com/_PDF/mic841.pdf; Stock Date: 2/27/2013; Stock Quantity: 1
U20 = IC00026: IC, DC/DC boost,Adjustable, 6 VIN, 500mA, MSOP10; Part Number: IC00026; Manufacturer 2: Torex; Manufacturer Part Number 2: XC9128D45CAR-G; Supplier 1: Digi-Key; Supplier Part Number 1: 893-1104-1-ND; Supplier Price 1: 0.882; Stock Quantity: 8; Stock Date: 2/27/2013; ComponentLink1URL: http://www.torex.co.jp/english/products/dcdc_converters/data/XC9128~29.pdf
U30 = IC00167: IC, Sensor, ALS, I2C, QFN10; Part Number: IC00167; Supplier 1: Digi-Key; Supplier Part Number 1: 336-2622-1-ND; Supplier Price 1: 1.8684; ComponentLink1URL: http://www.digikey.com/product-detail/en/SI1145-A10-GMR/336-2622-1-ND/4515975
U40 = IC00168: IC, Sensor, Magnetometer, I2C, LGA12; Part Number: IC00168; Supplier 1: Digi-Key; Supplier Part Number 1: 497-13892-1-ND; Supplier Price 1: 0.83589; ComponentLink1URL: http://www.digikey.com/product-detail/en/LIS3MDLTR/497-13892-1-ND/4309737
U50 = IC00038: IC, Accelerometer, 3-Axis, Low Power, 16-bit, LGA16; Part Number: IC00038; Manufacturer Part Number: LIS3DHTR; Supplier 1: Digi-Key; Supplier Part Number 1: 497-10613-1-ND; Supplier Price 1: 1.09366; Supplier 2: Mouser; Supplier Part Number 2: 511-LIS3DHTR; Supplier Price 2: 1.06; ComponentLink1URL: http://www.st.com/internet/com/TECHNICAL_RESOURCES/TECHNICAL_LITERATURE/DATASHEET/CD00274221.pdf; Stock Date: 3/5/2013; Stock Quantity: 15
U60 = IC00166: IC, Sensor, Barometer, I2C, +/-1millibar, 10-TFLGA; Part Number: IC00166; Supplier 1: Digi-Key; Supplier Part Number 1: 497-14380-1-ND; Supplier Price 1: 2.06928; ComponentLink1URL: http://www.digikey.com/product-detail/en/LPS25HTR/497-14380-1-ND/4725837
U80 = IC00157: IC, Sensor, Temp+Humidity, SI7021, +/-2% RH, DFN6; Part Number: IC00157; Supplier 1: Digi-Key; Supplier Part Number 1: 336-2542-1-ND; Supplier Price 1: 3.9528
U90 = IC00029: IC, Sensor,ALS,I2C,640nm/940nm,SMT; Part Number: IC00029; Supplier 1: Mouser; Supplier Part Number 1: 856-TSL2561FN; Supplier Price 1: 0.764; ComponentLink1URL: http://www.ams.com/eng/Products/Light-Sensors/Ambient-Light-Sensor-ALS/TSL2561; Stock Date: 2/27/2013; Stock Quantity: 7